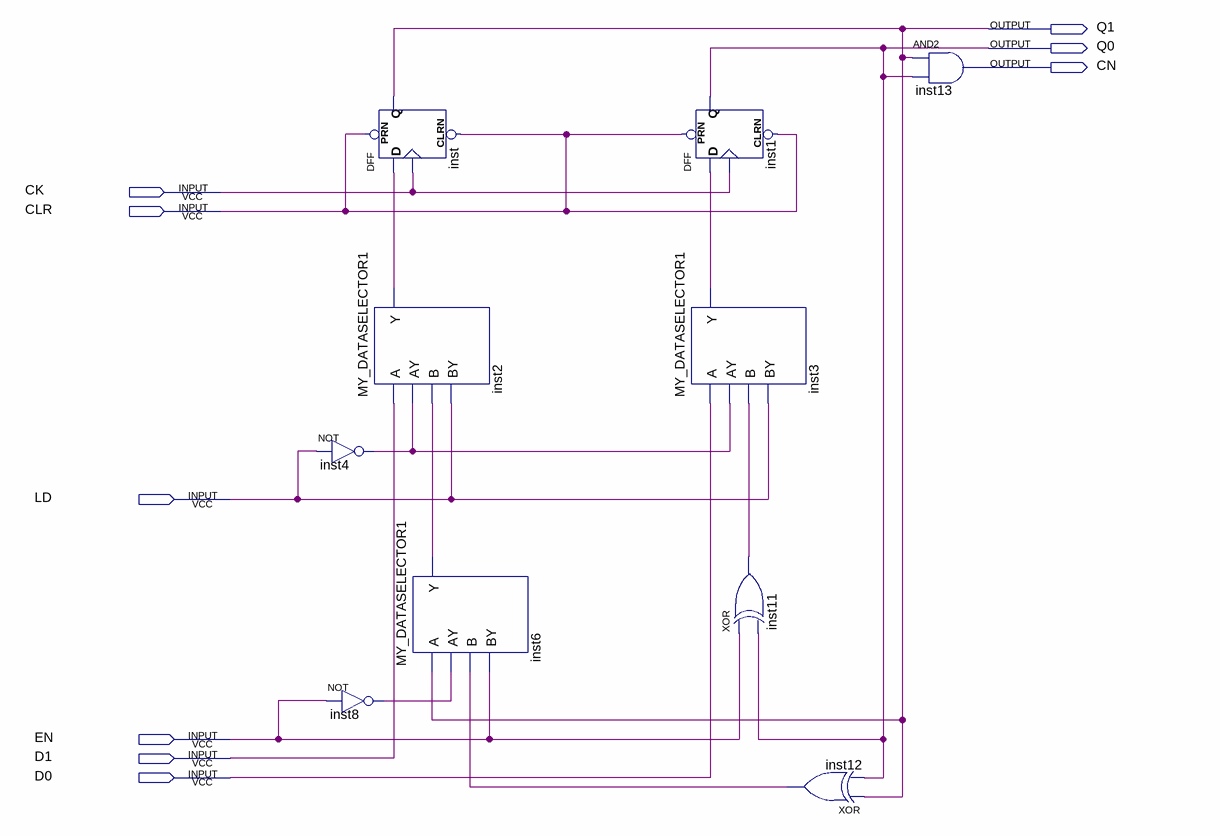
[diagram p0: schematic sheet]
// Quartus schematic SOUNTER2.bdf as structural Verilog: 10 symbols, 9 pins
module SOUNTER2 (
  input  CK,
  input  CLR,
  input  LD,
  input  EN,
  input  D1,
  input  D0,
  output Q1,
  output Q0,
  output CN
);

  wire inst2_y, inst3_y, inst4_out, inst6_y, inst8_out, inst11_out, inst12_out;

  DFF inst (.CLRN(CLR), .CLK(CK), .D(inst2_y), .PRN(CLR), .Q(Q1));
  MY_DATASELECTOR1 inst2 (.A(D1), .AY(inst4_out), .B(inst6_y), .BY(LD), .Y(inst2_y));
  not inst4 (inst4_out, LD);
  not inst8 (inst8_out, EN);
  MY_DATASELECTOR1 inst6 (.A(Q1), .AY(inst8_out), .B(inst12_out), .BY(EN), .Y(inst6_y));
  DFF inst1 (.CLRN(CLR), .CLK(CK), .D(inst3_y), .PRN(CLR), .Q(Q0));
  MY_DATASELECTOR1 inst3 (.A(D0), .AY(inst4_out), .B(inst11_out), .BY(LD), .Y(inst3_y));
  xor inst11 (inst11_out, EN, Q0);
  xor inst12 (inst12_out, Q1, Q0);
  and inst13 (CN, Q1, Q0);
endmodule
